# EAGLE design Precharge_Board (EAGLE 5.12)
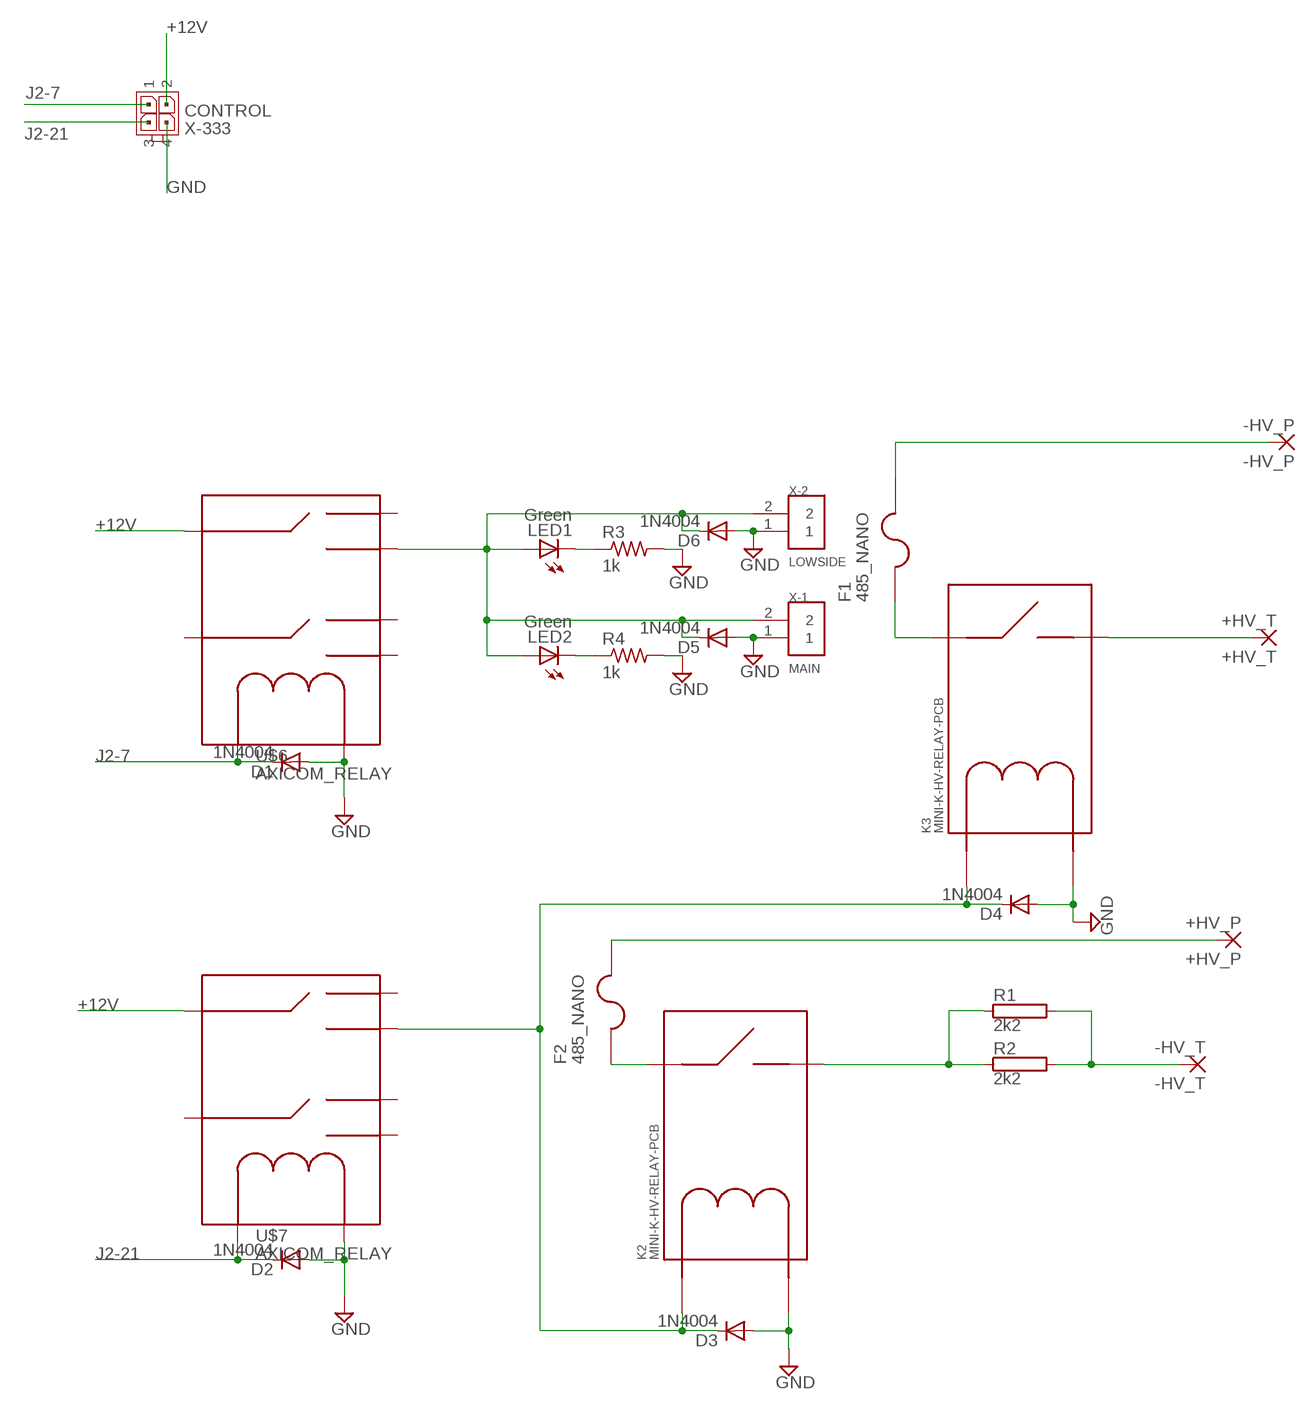
[diagram p0: schematic, sheet 1]

## Parts
+HV_P  +HV_P  2,54/1,1  [2,54/1,1]
+HV_T  +HV_T  2,54/1,1  [2,54/1,1]
-HV_P  -HV_P  2,54/1,1  [2,54/1,1]
-HV_T  -HV_T  2,54/1,1  [2,54/1,1]
D1  1N4004  [DO41-10]
D2  1N4004  [DO41-10]
D3  1N4004  [DO41-10]
D4  1N4004  [DO41-10]
D5  1N4004  [DO41-10]
D6  1N4004  [DO41-10]
F1  485_NANO  [485_NANO]
F2  485_NANO  [485_NANO]
K2  MINI-K-HV-RELAY-PCB  [MINI-K-RELAY_V23700C_PCB]
K3  MINI-K-HV-RELAY-PCB  [MINI-K-RELAY_V23700C_PCB]
LED1  Green  LEDSML0805  [SML0805]
LED2  Green  LEDSML0805  [SML0805]
R1  2k2  RMG100-V  [TO-247-2V]
R2  2k2  RMG100-V  [TO-247-2V]
R3  1k  R-US_R0603  [R0603]
R4  1k  R-US_R0603  [R0603]
U$6  AXICOM_RELAY  [AXICOM_RELAY]
U$7  AXICOM_RELAY  [AXICOM_RELAY]
X-1  MAIN  DURACLIK02  [DURACLIK-02]
X-2  LOWSIDE  DURACLIK02  [DURACLIK-02]
X-333  CONTROL  MICROFIT-04-DUAL-RA-SMD-CLIP_RETENTION  [MICROFIT-4-DUAL-RA-SMD-CLIP_RETENTION]

## Nets
+12V: U$6.L1 U$7.L1 X-333.2
+HV_P: +HV_P.1(P) F2.P$2
+HV_T: +HV_T.1(P) K3.7
-HV_P: -HV_P.1(P) F1.P$2
-HV_T: -HV_T.1(P) R1.2 R2.2
GND: D1.A D2.A D3.A D4.A D5.A D6.A K2.2(COIL-) K3.2(COIL-) R3.2 R4.2 U$6.COIL(-) U$7.COIL(-) X-1.1 X-2.1 X-333.4
J2-7: D1.C U$6.COIL(+) X-333.1
J2-21: D2.C U$7.COIL(+) X-333.3
N$1: F2.P$1 K2.5
N$2: LED1.C R3.1
N$3: D3.C D4.C K2.1(COIL+) K3.1(COIL+) U$7.NO1
N$4: K2.7 R1.1 R2.1
N$5: D5.C D6.C LED1.A LED2.A U$6.NO1 X-1.2 X-2.2
N$6: LED2.C R4.1
N$11: F1.P$1 K3.5
Unconnected: U$6.L2 U$6.NC1 U$6.NC2 U$6.NO2 U$7.L2 U$7.NC1 U$7.NC2 U$7.NO2

## Library data of the parts
+HV_P +HV_T -HV_P -HV_T = wirepad:2,54/1,1: THROUGH-HOLE PAD
D1-D6 = diode:1N4004: DIODE general purpose rectifier, 1 A
F1 F2 = Littelfuse:485_NANO
K2 K3 = TE-Aaron:MINI-K-HV-RELAY: TE Mini K HV Relay; PARTNO: V23700-C0001-A408
LED1 LED2 = led:LED: LED OSRAM: - CHIPLED LG R971, LG N971, LY N971, LG Q971, LY Q971, LO R971, LY R971 LH N974, LH R974 LS Q976, LO Q976, LY Q976 LO Q996 - Hyper CHIPLED LW Q18S LB Q993, LB Q99A, LB R99A - SideLED LS A670, LO A670, LY A670, LG A670, LP A670 LB A673, LV A673, LT A673, LW A673 LH A674 LY A675 LS A676, LA A676, LO A676, LY A676, LW A676 LS A679, LY A679, LG A679 - Hyper Micro SIDELED® LS Y876, LA Y876, LO Y876, LY Y876 LT Y87S - SmartLED LW L88C, LW L88S LB L89C, LB L89S, LG L890 LS L89K, LO L89K, LY L89K LS L896, LA L896, LO L896, LY L896 - TOPLED LS T670, LO T670, LY T670, LG T670, LP T670 LSG T670, LSP T670, LSY T670, LOP T670, LYG T670 LG T671, LOG T671, LSG T671 LB T673, LV T673, LT T673, LW T673 LH T674 LS T676, LA T676, LO T676, LY T676, LB T676, LH T676, LSB T676, LW T676 LB T67C, LV T67C, LT T67C, LS T67K, LO T67K, LY T67K, LW E67C LS E67B, LA E67B, LO E67B, LY E67B, LB E67C, LV E67C, LT E67C LW T67C LS T679, LY T679, LG T679 LS T770, LO T770, LY T770, LG T770, LP T770 LB T773, LV T773, LT T773, LW T773 LH T774 LS E675, LA E675, LY E675, LS T675 LS T776, LA T776, LO T776, LY T776, LB T776 LHGB T686 LT T68C, LB T68C - Hyper Mini TOPLED® LB M676 - Mini TOPLED Santana® LG M470 LS M47K, LO M47K, LY M47K Source: http://www.osram.convergy.de LUXEON: - LUMILED® LXK2-PW12-R00, LXK2-PW12-S00, LXK2-PW14-U00, LXK2-PW14-V00 LXK2-PM12-R00, LXK2-PM12-S00, LXK2-PM14-U00 LXK2-PE12-Q00, LXK2-PE12-R00, LXK2-PE12-S00, LXK2-PE14-T00, LXK2-PE14-U00 LXK2-PB12-K00, LXK2-PB12-L00, LXK2-PB12-M00, LXK2-PB14-N00, LXK2-PB14-P00, LXK2-PB14-Q00 LXK2-PR12-L00, LXK2-PR12-M00, LXK2-PR14-Q00, LXK2-PR14-R00 LXK2-PD12-Q00, LXK2-PD12-R00, LXK2-PD12-S00 LXK2-PH12-R00, LXK2-PH12-S00 LXK2-PL12-P00, LXK2-PL12-Q00, LXK2-PL12-R00 Source: www.luxeon.com KINGBRIGHT: KA-3528ASYC Source: www.kingbright.com
R1 R2 = resistor-power:RMG100: TO-247 Power Resistor - RMG 100 Series Source: www.token.com.tw .. power-resistor-rmg100pdf; OC_FARNELL: unknown; OC_NEWARK: unknown
R3 R4 = rcl:R-US_: RESISTOR, American symbol
U$6 U$7 = TE:AXICOM_RELAY: Datasheet: http://datasheet.octopart.com/5-1393788-7-Tyco-Electronics-datasheet-511509.pdf Axicom Relay used in HV Ctrl Ckt Ndd 11/30; PARTNO: V23079D1003B301
X-1 X-2 = BMC components:DURACLIK
X-333 = Molex:MICROFIT-04-DUAL: Molex MicroFit 3.00mm Pitch Header, Surface Mount, Dual Row, 4 Circuits Molex P/N: 43045-0609 (vert) Drawing: http://www.molex.com/pdm_docs/sd/430450418_sd.pdf (vert) Information: http://www.molex.com/molex/products/datasheet.jsp?part=active/0430450418_PCB_HEADERS.xml (vert)

## Net classes
0 default: width 0.406 mm

## Board
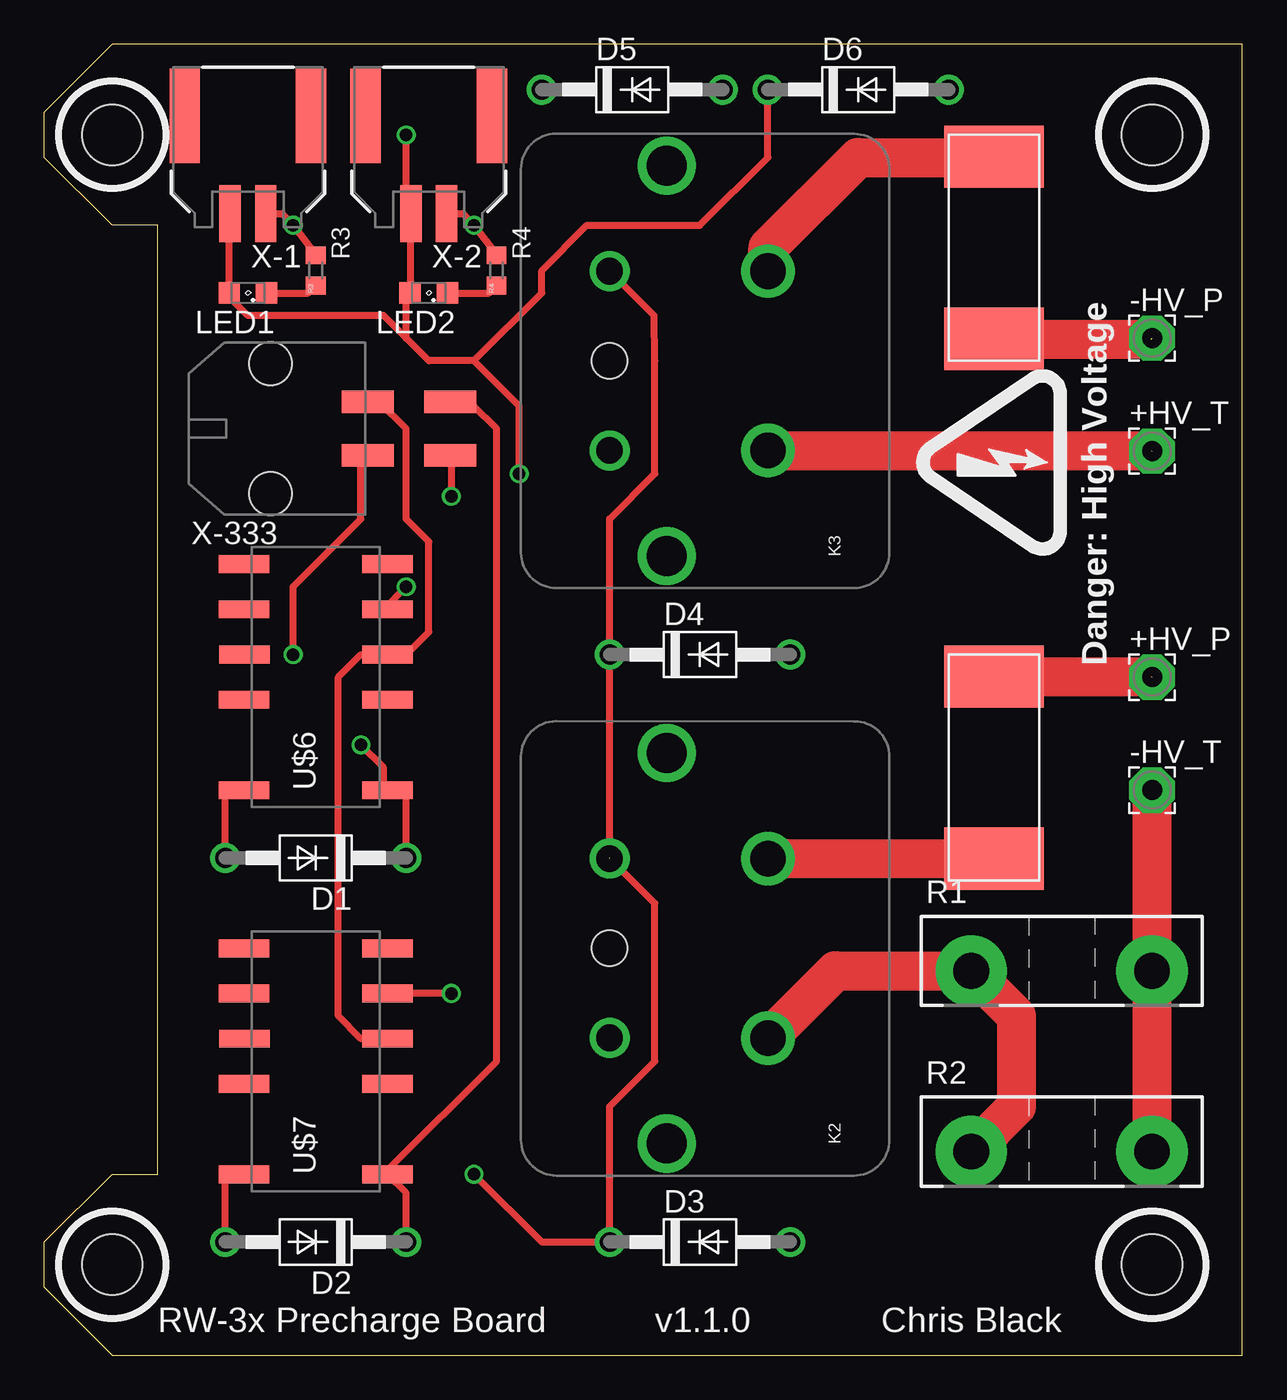
[diagram p1: board, top side]
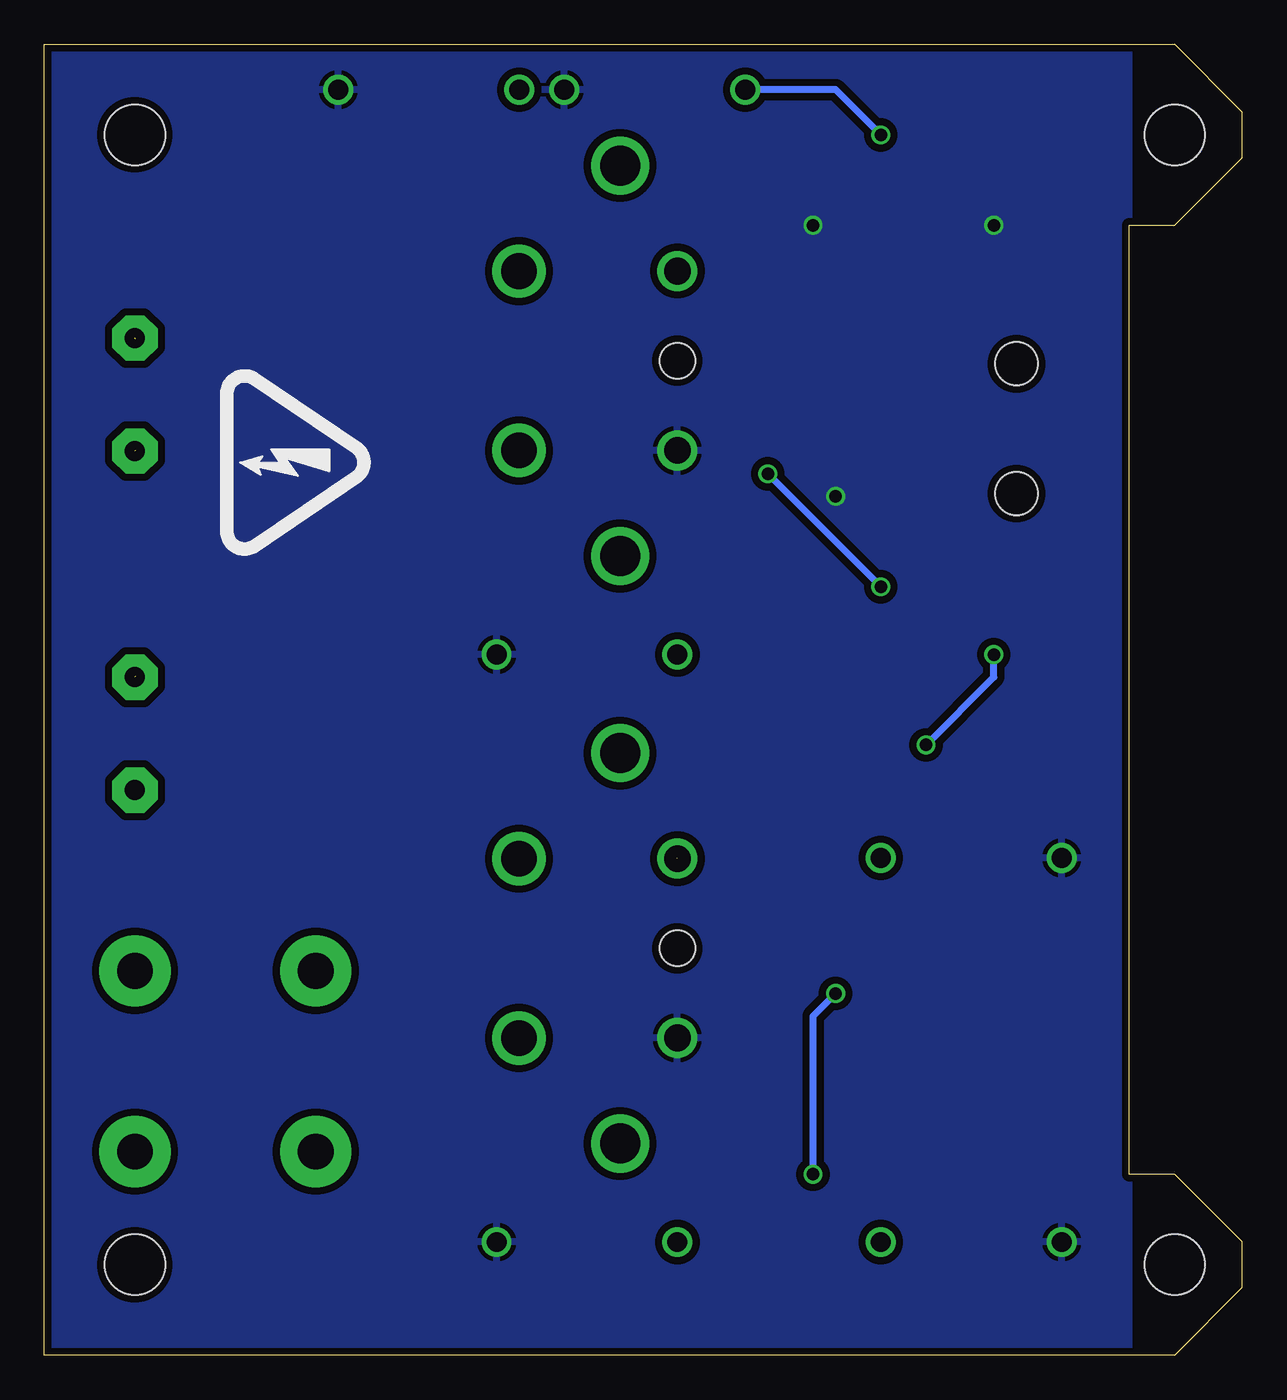
[diagram p2: board, bottom side, seen from below]

Size 67.31 x 73.66 mm. Coordinates in mm from the lower left corner, seen from the top.
Outline: 3.81,0 0,3.81 0,6.35 3.81,10.16 6.35,10.16 6.35,63.5 3.81,63.5 0,67.31 0,69.85 3.81,73.66 67.31,73.66 67.31,0 3.81,0
Copper layers (1*16): Top 0.0356mm / dielectric 1.5011mm / Bottom 0.0356mm
Design rules "OSH Park 2-layer": minimum track width 6mil, minimum drill 13mil, track to track 6mil, track to pad 6mil, pad to pad 6mil, via to via 6mil, smd to smd 6mil, copper to edge 15mil, drill to drill 6mil, minimum pad ring 7mil, minimum via ring 7mil, stop-mask expansion 4mil, vias tented up to drill 25mil, thermal gap 10mil
Holes 3.4 mm at 62.23,5.08 3.81,5.08 62.23,68.58 3.81,68.58

### Footprints (pad centres in the part's own frame; a part is rotated, then mirrored left to right if it is on the bottom)
2,54/1,1 = drill 1.118 pad 2.54 octagon: 1 0,0
DO41-10 = drill 1.118 round: A 5.08,0; C -5.08,0
485_NANO = smd 3.5 x 5.6: P$1 5.12,0; P$2 -5.12,0
MINI-K-RELAY_V23700C_PCB = drill 1.5 round: 1 5.04,0; 2 -5.04,0 | drill 2 round: 5 5.04,-8.9; 7 -5.04,-8.9 | drill 2.25 round: 8A -10.975,-3.22; 8B 10.975,-3.22 | hole 2: 0,0
SML0805 = smd 1.2 x 1.2: A 1.05,0; C -1.05,0
TO-247-2V = drill 2 pad 4 round: 1 -5.08,0; 2 5.08,0
R0603 = smd 1 x 1.1: 1 -0.85,0; 2 0.85,0
AXICOM_RELAY = smd 1 x 2.85: COIL(+) -6.35,-4.025; COIL(-) -6.35,4.025; L1 1.27,-4.025; L2 1.27,4; NC1 -1.27,-4.025; NC2 -1.27,4.025; NO1 3.81,-4.025; NO2 3.81,4.025; NOUSE1 6.35,-4.025; NOUSE2 6.35,4.025
DURACLIK-02 = smd 1.2 x 3.2: 1 -1,8.23; 2 1,8.23 | smd 1.7 x 5.3: P$3 -3.55,2.75; P$4 3.55,2.75
MICROFIT-4-DUAL-RA-SMD-CLIP_RETENTION = smd 1.27 x 2.921: 1 1.5,5.47; 2 -1.5,5.47; 3 -1.5,10.1; 4 1.5,10.1 | hole 2.413: 3.65,0; -3.65,0

### Placement (x,y rotation side)
+HV_P  62.23,38.1 0 top
+HV_T  62.23,50.8 0 top
-HV_P  62.23,57.15 0 top
-HV_T  62.23,31.75 0 top
D1  15.24,27.94 180 top
D2  15.24,6.35 180 top
D3  36.83,6.35 0 top
D4  36.83,39.37 0 top
D5  33.02,71.12 0 top
D6  45.72,71.12 0 top
F1  53.34,62.23 90 top
F2  53.34,33.02 270 top
K2  31.75,22.86 90 top
K3  31.75,55.88 90 top
LED1  11.43,59.69 180 top
LED2  21.59,59.69 180 top
R1  57.15,21.59 0 top
R2  57.15,11.43 0 top
R3  15.24,60.96 90 top
R4  25.4,60.96 90 top
U$1  [HV_SYMBOL]  52.07,50.16 90 top
U$2  [HV_SYMBOL]  52.07,50.16 270 bottom
U$6  15.24,38.1 90 top
U$7  15.24,16.51 90 top
X-1  11.43,72.39 180 top
X-2  21.59,72.39 180 top
X-333  12.7,52.07 270 top

### Tracks (layer width: path | path; a pad name or v marks a point on that pad's centre or on a via)
+12V
  Top 0.406: X-333.2 18.82,53.57 20.32,52.07 20.32,46.99 21.59,45.72 21.59,40.64 20.32,39.37 U$6.L1 17.78,39.37 16.51,38.1 16.51,19.05 17.78,17.78 U$7.L1
+HV_P  (1 unrouted)
  Top 2.184: F2.P$2 62.19,38.14
+HV_T  (1 unrouted)
  Top 2.184: K3.7 62.19,50.84
-HV_P  (1 unrouted)
  Top 2.184: F1.P$2 62.19,57.11
-HV_T
  Top 2.184: R2.2 R1.2 -HV_T.1
GND  (via drill 0.7)
  Top 0.406: D2.A 10.16,10.16 U$7.COIL(-) | D1.A 10.16,31.75 U$6.COIL(-) | X-333.4 22.86,50.57 v22.86,48.26 | R3.2 v13.97,63.5 13.36,64.16 X-1.1 | R4.2 v24.13,63.5 23.52,64.16 X-2.1
  pour Bottom (isolate 0.406): 6.35,73.66 67.31,73.66 67.31,0 6.35,0
J2-7  (via drill 0.7)
  Top 0.406: D1.C 20.32,31.75 U$6.COIL(+) 19.05,31.96 19.05,33.02 v17.78,34.29 | v13.97,39.37 13.97,43.18 17.78,46.99 17.78,50.18 X-333.1
  Bottom 0.406: v13.97,39.37 13.97,38.1 v17.78,34.29
J2-21
  Top 0.406: D2.C 20.32,9.11 U$7.COIL(+) 19.27,10.38 25.4,16.51 25.4,52.07 24.13,53.34 23.03,53.34 X-333.3
N$1
  Top 2.184: K2.5 F2.P$1
N$2
  Top 0.406: LED1.C 14.82,59.69 R3.1
N$3  (via drill 0.7)  (1 unrouted)
  Top 0.406: K3.1 34.25,58.42 34.29,55.88 34.29,49.53 31.75,46.99 D4.C 31.75,27.94 | K2.1 34.25,25.4 34.29,25.4 34.29,16.51 31.75,13.97 D3.C 27.94,6.35 v24.13,10.16 | v22.86,20.32 U$7.NO1
  Bottom 0.406: v24.13,10.16 24.13,19.05 v22.86,20.32
N$4
  Top 2.184: K2.7 40.68,17.82 44.45,21.59 R1.1 54.61,19.05 54.61,13.97 R2.1
N$5  (via drill 0.7, 0.7 pad 0.41)
  Top 0.406: v20.32,43.18 19.05,41.91 U$6.NO1 | v26.67,49.53 26.67,53.34 24.13,55.88 | 24.13,55.88 21.59,55.88 20.32,57.15 | 20.59,63.77 20.32,63.5 | LED1.A 10.38,59.47 11.43,58.42 19.05,58.42 20.32,57.15 | 20.32,57.15 20.32,59.69 LED2.A 20.59,59.74 20.59,63.77 | LED1.A 10.16,59.69 | 20.59,63.77 X-2.2 | LED1.A 10.38,64.11 X-1.2 | 20.32,64.43 v20.32,68.58 | D6.C 40.64,67.31 36.83,63.5 30.48,63.5 27.94,60.96 27.94,59.69 24.13,55.88
  Top 0.61: X-2.2 20.32,64.43
  Bottom 0.406: v20.32,43.18 v26.67,49.53 | D5.C 22.86,71.12 v20.32,68.58
N$6
  Top 0.406: LED2.C 24.98,59.69 R4.1
N$11
  Top 2.184: K3.5 40.65,62.24 45.72,67.31 53.3,67.31 F1.P$1

### Text on the board
tNames: R3 | R4 | Danger: High Voltage | RW-3x Precharge Board | v1.1.0 | Chris Black